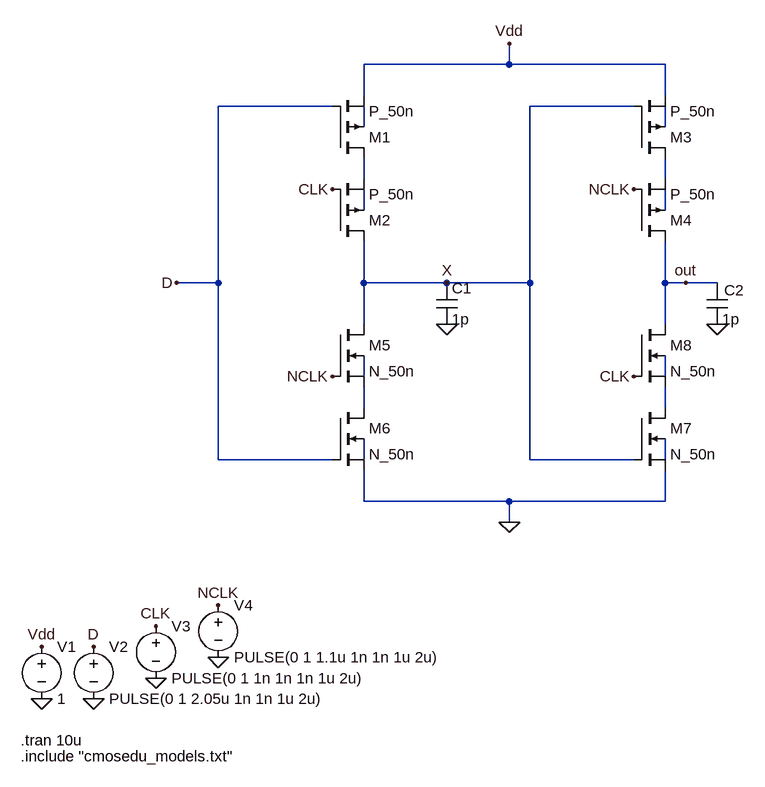
[diagram p0: schematic 1EstudioDeSolapamiento.asc]
1EstudioDeSolapamiento.asc, the LTspice schematic file:
Version 4
SHEET 1 916 1032
WIRE 320 -48 320 -80
WIRE 320 -48 96 -48
WIRE 560 -48 320 -48
WIRE 96 0 96 -48
WIRE 560 0 560 -48
WIRE 48 16 -128 16
WIRE 512 16 352 16
WIRE 96 48 96 16
WIRE 560 48 560 16
WIRE 96 128 96 96
WIRE 560 128 560 96
WIRE 96 176 96 144
WIRE 560 176 560 144
WIRE -128 288 -128 16
WIRE -128 288 -192 288
WIRE 96 288 96 224
WIRE 224 288 96 288
WIRE 352 288 352 16
WIRE 352 288 224 288
WIRE 560 288 560 224
WIRE 592 288 560 288
WIRE 640 288 592 288
WIRE 96 352 96 288
WIRE 560 352 560 288
WIRE 96 432 96 400
WIRE 560 432 560 400
WIRE 96 480 96 448
WIRE 560 480 560 448
WIRE -128 560 -128 288
WIRE 48 560 -128 560
WIRE 96 560 96 528
WIRE 352 560 352 288
WIRE 512 560 352 560
WIRE 560 560 560 528
WIRE 96 624 96 576
WIRE 320 624 96 624
WIRE 560 624 560 576
WIRE 560 624 320 624
WIRE 320 656 320 624
FLAG 320 656 0
FLAG 320 -80 Vdd
FLAG -192 288 D
FLAG -400 928 0
FLAG -320 928 0
FLAG -224 896 0
FLAG -400 848 Vdd
FLAG -320 848 D
FLAG -128 864 0
FLAG -128 784 NCLK
FLAG 48 144 CLK
FLAG 512 432 CLK
FLAG 48 432 NCLK
FLAG 512 144 NCLK
FLAG 592 288 out
FLAG 224 288 X
FLAG -224 816 CLK
FLAG 224 352 0
FLAG 640 352 0
SYMBOL pmos4 48 96 M180
SYMATTR InstName M1
SYMATTR Value2 l=50n w=600n
SYMATTR Value P_50n
SYMBOL nmos4 48 352 R0
SYMATTR InstName M5
SYMATTR Value2 l=50n w=400n
SYMATTR Value N_50n
SYMBOL voltage -400 832 R0
WINDOW 123 0 0 Left 0
WINDOW 39 0 0 Left 0
SYMATTR InstName V1
SYMATTR Value 1
SYMBOL voltage -320 832 R0
WINDOW 123 0 0 Left 0
WINDOW 39 0 0 Left 0
SYMATTR InstName V2
SYMATTR Value PULSE(0 1 2.05u 1n 1n 1u 2u)
SYMBOL voltage -224 800 R0
WINDOW 123 0 0 Left 0
WINDOW 39 0 0 Left 0
SYMATTR InstName V3
SYMATTR Value PULSE(0 1 1n 1n 1n 1u 2u)
SYMBOL voltage -128 768 R0
WINDOW 123 0 0 Left 0
WINDOW 39 0 0 Left 0
SYMATTR InstName V4
SYMATTR Value PULSE(0 1 1.1u 1n 1n 1u 2u)
SYMBOL pmos4 48 224 M180
SYMATTR InstName M2
SYMATTR Value2 l=50n w=600n
SYMATTR Value P_50n
SYMBOL pmos4 512 96 M180
SYMATTR InstName M3
SYMATTR Value2 l=50n w=600n
SYMATTR Value P_50n
SYMBOL pmos4 512 224 M180
SYMATTR InstName M4
SYMATTR Value2 l=50n w=600n
SYMATTR Value P_50n
SYMBOL nmos4 48 480 R0
SYMATTR InstName M6
SYMATTR Value2 l=50n w=400n
SYMATTR Value N_50n
SYMBOL nmos4 512 480 R0
SYMATTR InstName M7
SYMATTR Value2 l=50n w=400n
SYMATTR Value N_50n
SYMBOL nmos4 512 352 R0
SYMATTR InstName M8
SYMATTR Value2 l=50n w=400n
SYMATTR Value N_50n
SYMBOL cap 208 288 R0
SYMATTR InstName C1
SYMATTR Value 1p
SYMBOL cap 624 288 R0
WINDOW 0 27 11 Left 2
SYMATTR InstName C2
SYMATTR Value 1p
TEXT -432 992 Left 2 !.tran 10u
TEXT -432 1016 Left 2 !.include "cmosedu_models.txt"

The netlist it stands for:
* 1EstudioDeSolapamiento.asc
M1 N003 D Vdd N001 P_50n l=50n w=600n
M5 X NCLK N009 N007 N_50n l=50n w=400n
V1 Vdd 0 1
V2 D 0 PULSE(0 1 2.05u 1n 1n 1u 2u)
V3 CLK 0 PULSE(0 1 1n 1n 1n 1u 2u)
V4 NCLK 0 PULSE(0 1 1.1u 1n 1n 1u 2u)
M2 X CLK N003 N005 P_50n l=50n w=600n
M3 N004 X Vdd N002 P_50n l=50n w=600n
M4 out NCLK N004 N006 P_50n l=50n w=600n
M6 N009 D 0 N011 N_50n l=50n w=400n
M7 N010 X 0 N012 N_50n l=50n w=400n
M8 out CLK N010 N008 N_50n l=50n w=400n
C1 X 0 1p
C2 out 0 1p
.model NMOS NMOS
.model PMOS PMOS
.lib standard.mos
.tran 10u
.include "cmosedu_models.txt"
.backanno
.end